# EAGLE schematic pcb (EAGLE 9.5.2)
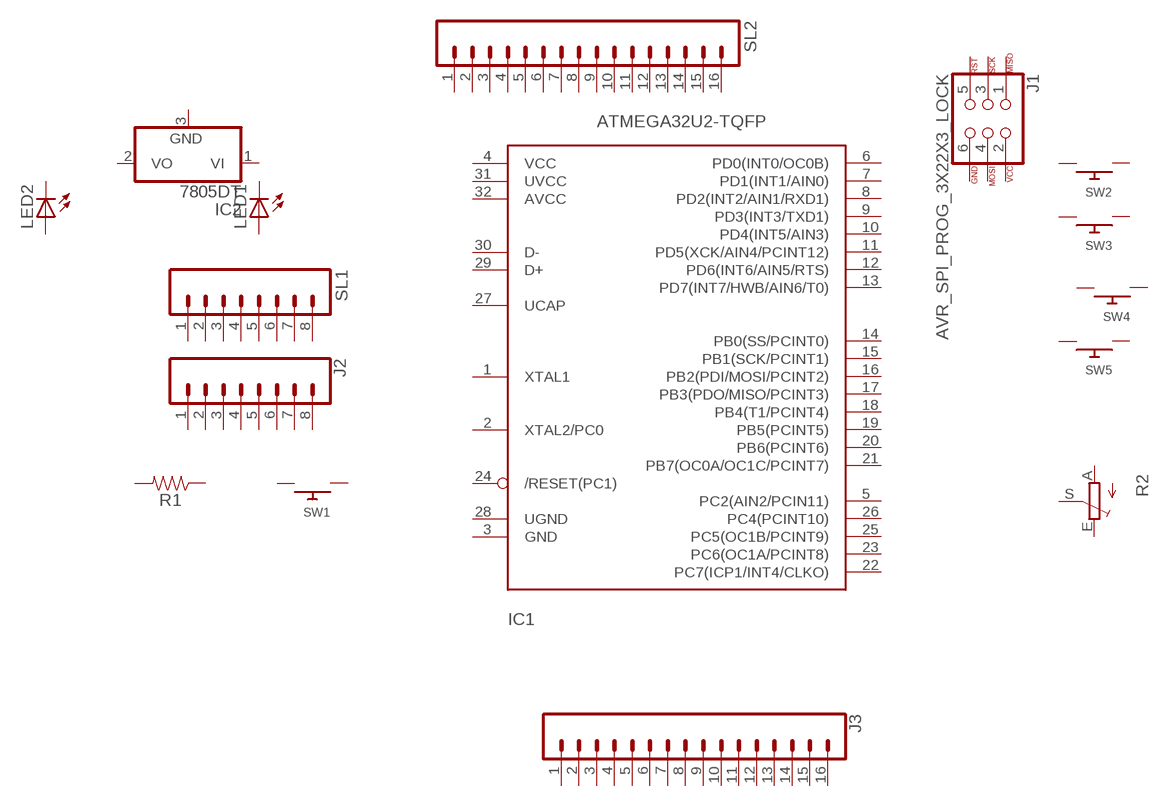
[diagram p0: schematic, sheet 1]

## Parts
IC1  ATMEGA32U2-TQFP  [TQFP32-08]
IC2  7805DT  [TO252]
J1  AVR_SPI_PROG_3X22X3_LOCK  [2X3_LOCK]
J2  CONN_08BM08B-SRSS-TB  [BM08B-SRSS-TB]
J3  CONN_16LONGPADS  [1X16_LONGPADS]
LED1  LED1206  [LED-1206]
LED2  LED1206  [LED-1206]
R1  RESISTOR1206  [1206]
R2  TRIM_EU-CA6V  [CA6V]
SL1  M08  [08P]
SL2  M16  [16P]
SW1  SWITCH_PUSHBUTTONEVQ-PE  [TACT_PANA-EVQ]
SW2  SWITCH_PUSHBUTTONEVQ-PE  [TACT_PANA-EVQ]
SW3  SWITCH_PUSHBUTTONEVQ-PE  [TACT_PANA-EVQ]
SW4  SWITCH_PUSHBUTTONEVQ-PE  [TACT_PANA-EVQ]
SW5  SWITCH_PUSHBUTTONEVQ-PE  [TACT_PANA-EVQ]
Unconnected: IC1.1(XTAL1) IC1.2(XTAL2/PC0) IC1.3(GND) IC1.4(VCC) IC1.5(PC2(AIN2/PCIN11)) IC1.6(PD0(INT0/OC0B)) IC1.7(PD1(INT1/AIN0)) IC1.8(PD2(INT2/AIN1/RXD1)) IC1.9(PD3(INT3/TXD1)) IC1.10(PD4(INT5/AIN3)) IC1.11(PD5(XCK/AIN4/PCINT12)) IC1.12(PD6(INT6/AIN5/RTS)) IC1.13(PD7(INT7/HWB/AIN6/T0)) IC1.14(PB0(SS/PCINT0)) IC1.15(PB1(SCK/PCINT1)) IC1.16(PB2(PDI/MOSI/PCINT2)) IC1.17(PB3(PDO/MISO/PCINT3)) IC1.18(PB4(T1/PCINT4)) IC1.19(PB5(PCINT5)) IC1.20(PB6(PCINT6)) IC1.21(PB7(OC0A/OC1C/PCINT7)) IC1.22(PC7(ICP1/INT4/CLKO)) IC1.23(PC6(OC1A/PCINT8)) IC1.24(/RESET(PC1)) IC1.25(PC5(OC1B/PCINT9)) IC1.26(PC4(PCINT10)) IC1.27(UCAP) IC1.28(UGND) IC1.29(D+) IC1.30(D-) IC1.31(UVCC) IC1.32(AVCC) IC2.1(VI) IC2.2(VO) IC2.3(GND) J1.1 J1.2 J1.3 J1.4 J1.5 J1.6 J2.1 J2.2 J2.3 J2.4 J2.5 J2.6 J2.7 J2.8 J3.1 J3.2 J3.3 J3.4 J3.5 J3.6 J3.7 J3.8 J3.9 J3.10 J3.11 J3.12 J3.13 J3.14 J3.15 J3.16 LED1.A LED1.C LED2.A LED2.C R1.1 R1.2 R2.A R2.E R2.S SL1.1 SL1.2 SL1.3 SL1.4 SL1.5 SL1.6 SL1.7 SL1.8 SL2.1 SL2.2 SL2.3 SL2.4 SL2.5 SL2.6 SL2.7 SL2.8 SL2.9 SL2.10 SL2.11 SL2.12 SL2.13 SL2.14 SL2.15 SL2.16 SW1.P$1 SW1.P$2 SW2.P$1 SW2.P$2 SW3.P$1 SW3.P$2 SW4.P$1 SW4.P$2 SW5.P$1 SW5.P$2

## Library data of the parts
IC1 = adafruit:ATMEGA32U2: ATmega32u2 Pin compatible with the atmega8u2, atmega16u2 and atmega32u2 8, 16 or 32 K flash, 1K RAM, 512b EEPROM 8 bit and 16 bit timer (5 PWM total) UART, SPI (no I2C!) USB with 4 endpoints, LUFA compatible 22 I/O lines, analog comparator (no ADC!) Comes with DFU bootloader burned in!
IC2 = linear:78*: Positive VOLTAGE REGULATOR Source: http://cache.national.com/ds/LM/LM78L05.pdf http://www.fairchildsemi.com/ds/LM/LM7805.pdf
J1 = SparkFun-Connectors:AVR_SPI_PROG_3X2: AVR ISP 6 Pin This is the reduced ISP connector for AVR programming. Common on Arduino. This footprint will take up less PCB space and can be used with a 10-pin to 6-pin adapter such as SKU: BOB-08508 **Special note about "TEST_POINT" package. The stop mask is on the top side, so if you want your programming test points to be on the bottom of your board, make sure to place this package on the bottom side of the board. This also ensure that the orientation to program from the bottom side will be correct. SparkFun Products: SparkFun ISP Pogo Adapter <https://www.sparkfun.com/products/11591> - NS Tiny AVR Programmer <https://www.sparkfun.com/products/11801> -PTH
J2 = SparkFun-Connectors:CONN_08: Multi connection point. Often used as Generic Header-pin footprint for 0.1 inch spaced/style header connections On any of the 0.1 inch spaced packages, you can populate with these: Break Away Headers - Straight <https://www.sparkfun.com/products/116> (PRT-00116) Break Away Male Headers - Right Angle <https://www.sparkfun.com/products/553> (PRT-00553) Female Headers <https://www.sparkfun.com/products/115> (PRT-00115) Break Away Headers - Machine Pin <https://www.sparkfun.com/products/117> (PRT-00117) Break Away Female Headers - Swiss Machine Pin <https://www.sparkfun.com/products/743> (PRT-00743) Arduino Stackable Header - 8 Pin <https://www.sparkfun.com/products/9279> (PRT-09279) For SCREWTERMINALS and SPRING TERMINALS visit here: Screw Terimnals on SparkFun.com <https://www.sparkfun.com/search/results?term=Screw+Terminals> (5mm/3.5mm/2.54mm spacing) This device is also useful as a general connection point to wire up your design to another part of your project. Our various solder wires solder well into these plated through hole pads. Hook-Up Wire - Assortment (Stranded, 22 AWG) <https://www.sparkfun.com/products/11375> (PRT-11375) Hook-Up Wire - Assortment (Solid Core, 22 AWG) <https://www.sparkfun.com/products/11367> (PRT-11367) View the entire wire category on our website here <https://www.sparkfun.com/categories/141> Special notes: Molex polarized connector foot print use with SKU : PRT-08231 with associated crimp pins and housings. 1MM SMD Version SKU: PRT-10208 NOTES ON THE VARIANTS LOCK and LOCK_LONGPADS... This footprint was designed to help hold the alignment of a through-hole component (i.e. 6-pin header) while soldering it into place. You may notice that each hole has been shifted either up or down by 0.005 of an inch from it's more standard position (which is a perfectly straight line). This slight alteration caused the pins (the squares in the middle) to touch the edges of the holes. Because they are alternating, it causes a "brace" to hold the component in place. 0.005 has proven to be the perfect amount of "off-center" position when using our standard breakaway headers. Although looks a little odd when you look at the bare footprint, once you have a header in there, the alteration is very hard to notice. Also,if you push a header all the way into place, it is covered up entirely on the bottom side.; PROD_ID: CONN-10556
J3 = SparkFun-Connectors:CONN_16: Multi connection point. Often used as Generic Header-pin footprint for 0.1 inch spaced/style header connections On any of the 0.1 inch spaced packages, you can populate with these: Break Away Headers - Straight <https://www.sparkfun.com/products/116> (PRT-00116) Break Away Male Headers - Right Angle <https://www.sparkfun.com/products/553> (PRT-00553) Female Headers <https://www.sparkfun.com/products/115> (PRT-00115) Break Away Headers - Machine Pin <https://www.sparkfun.com/products/117> (PRT-00117) Break Away Female Headers - Swiss Machine Pin <https://www.sparkfun.com/products/743> (PRT-00743) For SCREWTERMINALS and SPRING TERMINALS visit here: Screw Terimnals on SparkFun.com <https://www.sparkfun.com/search/results?term=Screw+Terminals> (5mm/3.5mm/2.54mm spacing) This device is also useful as a general connection point to wire up your design to another part of your project. Our various solder wires solder well into these plated through hole pads. Hook-Up Wire - Assortment (Stranded, 22 AWG) <https://www.sparkfun.com/products/11375> (PRT-11375) Hook-Up Wire - Assortment (Solid Core, 22 AWG) <https://www.sparkfun.com/products/11367> (PRT-11367) View the entire wire category on our website here <https://www.sparkfun.com/categories/141> Special notes: Molex polarized connector foot print use with SKU : PRT-08231 with associated crimp pins and housings. 1MM SMD Version SKU: PRT-10208 NOTES ON THE VARIANTS LOCK and LOCK_LONGPADS... This footprint was designed to help hold the alignment of a through-hole component (i.e. 6-pin header) while soldering it into place. You may notice that each hole has been shifted either up or down by 0.005 of an inch from it's more standard position (which is a perfectly straight line). This slight alteration caused the pins (the squares in the middle) to touch the edges of the holes. Because they are alternating, it causes a "brace" to hold the component in place. 0.005 has proven to be the perfect amount of "off-center" position when using our standard breakaway headers. Although looks a little odd when you look at the bare footprint, once you have a header in there, the alteration is very hard to notice. Also,if you push a header all the way into place, it is covered up entirely on the bottom side.
LED1 LED2 = SparkFun-Retired:LED: LEDs Standard schematic elements and footprints for 5mm, 3mm, 1206, and 0603 sized LEDs. 5mm - Spark Fun Electronics SKU : Comp-SBL
R1 = SparkFun-Resistors:RESISTOR: Generic Resistor Package
R2 = pot:TRIM_EU-: POTENTIOMETER
SL1 = con-amp-quick:M08: AMP QUICK CONNECTOR; OC_FARNELL: unknown; OC_NEWARK: unknown
SL2 = con-amp-quick:M16: AMP QUICK CONNECTOR; OC_FARNELL: unknown; OC_NEWARK: unknown
SW1-SW5 = adafruit:SWITCH_PUSHBUTTON: Buttons SOFTTOUCHSMD_SJ - Soft touch temporary push button (Super Junk Akihabara) Compatible with SKPMANE010 [Mouser: 688-SKPMAN] C&K_KSS = Digikey: KSS221GLFS